# Altium schematic sheet panel6.SchDoc
size A
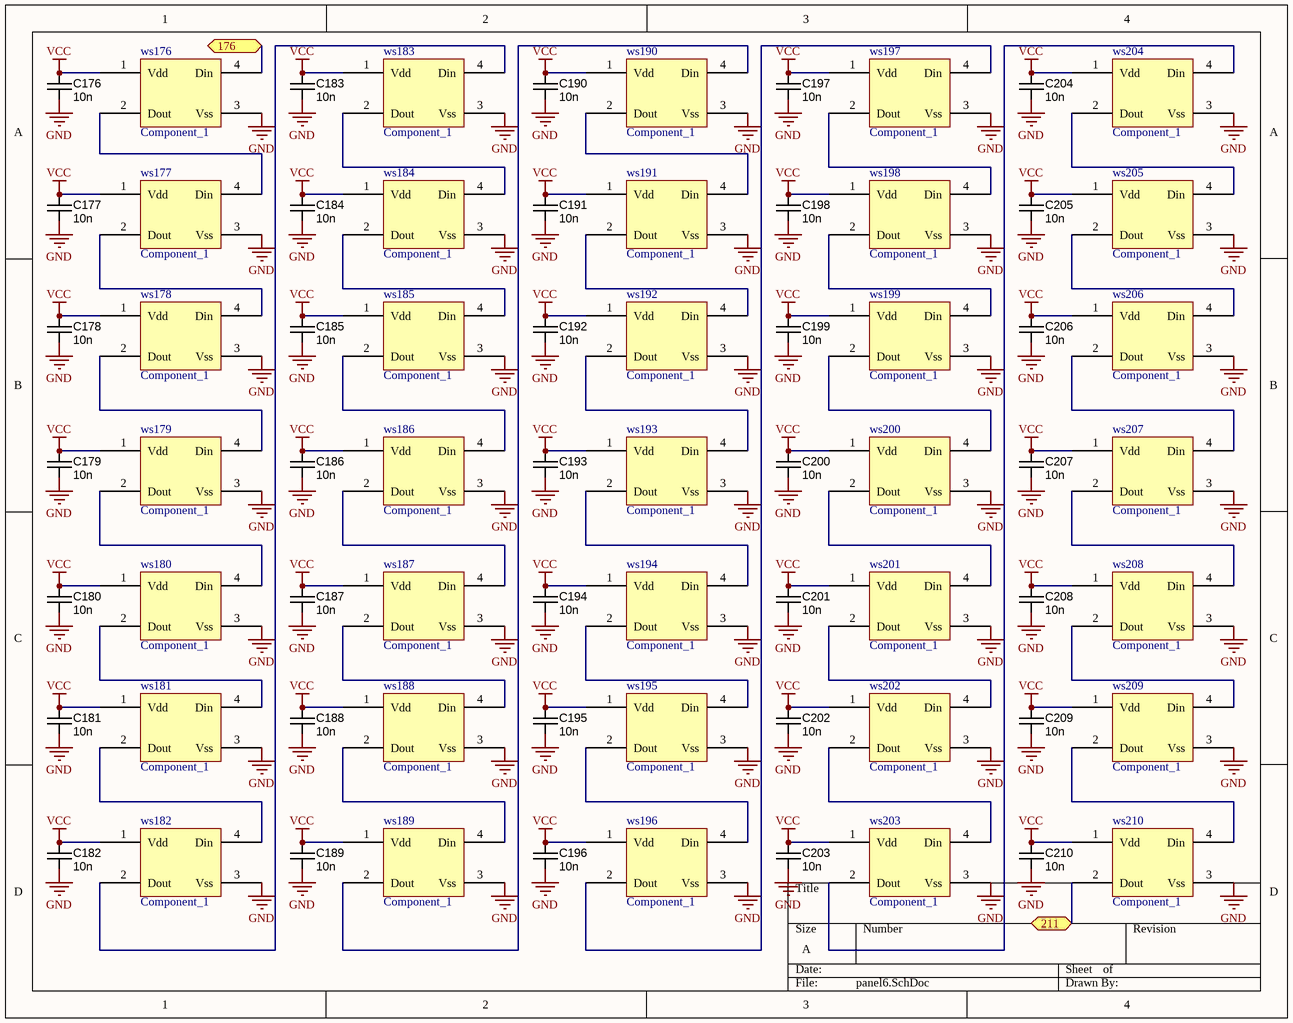
[diagram p0: panel6.SchDoc]

## Parts
C176  value 10n  [CAPC1608X90N]  (hidden comment: approved sub OK)
C177  value 10n  [CAPC1608X90N]  (hidden comment: approved sub OK)
C178  value 10n  [CAPC1608X90N]  (hidden comment: approved sub OK)
C179  value 10n  [CAPC1608X90N]  (hidden comment: approved sub OK)
C180  value 10n  [CAPC1608X90N]  (hidden comment: approved sub OK)
C181  value 10n  [CAPC1608X90N]  (hidden comment: approved sub OK)
C182  value 10n  [CAPC1608X90N]  (hidden comment: approved sub OK)
C183  value 10n  [CAPC1608X90N]  (hidden comment: approved sub OK)
C184  value 10n  [CAPC1608X90N]  (hidden comment: approved sub OK)
C185  value 10n  [CAPC1608X90N]  (hidden comment: approved sub OK)
C186  value 10n  [CAPC1608X90N]  (hidden comment: approved sub OK)
C187  value 10n  [CAPC1608X90N]  (hidden comment: approved sub OK)
C188  value 10n  [CAPC1608X90N]  (hidden comment: approved sub OK)
C189  value 10n  [CAPC1608X90N]  (hidden comment: approved sub OK)
C190  value 10n  [CAPC1608X90N]  (hidden comment: approved sub OK)
C191  value 10n  [CAPC1608X90N]  (hidden comment: approved sub OK)
C192  value 10n  [CAPC1608X90N]  (hidden comment: approved sub OK)
C193  value 10n  [CAPC1608X90N]  (hidden comment: approved sub OK)
C194  value 10n  [CAPC1608X90N]  (hidden comment: approved sub OK)
C195  value 10n  [CAPC1608X90N]  (hidden comment: approved sub OK)
C196  value 10n  [CAPC1608X90N]  (hidden comment: approved sub OK)
C197  value 10n  [CAPC1608X90N]  (hidden comment: approved sub OK)
C198  value 10n  [CAPC1608X90N]  (hidden comment: approved sub OK)
C199  value 10n  [CAPC1608X90N]  (hidden comment: approved sub OK)
C200  value 10n  [CAPC1608X90N]  (hidden comment: approved sub OK)
C201  value 10n  [CAPC1608X90N]  (hidden comment: approved sub OK)
C202  value 10n  [CAPC1608X90N]  (hidden comment: approved sub OK)
C203  value 10n  [CAPC1608X90N]  (hidden comment: approved sub OK)
C204  value 10n  [CAPC1608X90N]  (hidden comment: approved sub OK)
C205  value 10n  [CAPC1608X90N]  (hidden comment: approved sub OK)
C206  value 10n  [CAPC1608X90N]  (hidden comment: approved sub OK)
C207  value 10n  [CAPC1608X90N]  (hidden comment: approved sub OK)
C208  value 10n  [CAPC1608X90N]  (hidden comment: approved sub OK)
C209  value 10n  [CAPC1608X90N]  (hidden comment: approved sub OK)
C210  value 10n  [CAPC1608X90N]  (hidden comment: approved sub OK)
ws176  Component_1  [SOP4]
ws177  Component_1  [SOP4]
ws178  Component_1  [SOP4]
ws179  Component_1  [SOP4]
ws180  Component_1  [SOP4]
ws181  Component_1  [SOP4]
ws182  Component_1  [SOP4]
ws183  Component_1  [SOP4]
ws184  Component_1  [SOP4]
ws185  Component_1  [SOP4]
ws186  Component_1  [SOP4]
ws187  Component_1  [SOP4]
ws188  Component_1  [SOP4]
ws189  Component_1  [SOP4]
ws190  Component_1  [SOP4]
ws191  Component_1  [SOP4]
ws192  Component_1  [SOP4]
ws193  Component_1  [SOP4]
ws194  Component_1  [SOP4]
ws195  Component_1  [SOP4]
ws196  Component_1  [SOP4]
ws197  Component_1  [SOP4]
ws198  Component_1  [SOP4]
ws199  Component_1  [SOP4]
ws200  Component_1  [SOP4]
ws201  Component_1  [SOP4]
ws202  Component_1  [SOP4]
ws203  Component_1  [SOP4]
ws204  Component_1  [SOP4]
ws205  Component_1  [SOP4]
ws206  Component_1  [SOP4]
ws207  Component_1  [SOP4]
ws208  Component_1  [SOP4]
ws209  Component_1  [SOP4]
ws210  Component_1  [SOP4]

## Ports
176, 211

## Nets
GND: C176.2 C177.2 C178.2 C179.2 C180.2 C181.2 C182.2 C183.2 C184.2 C185.2 C186.2 C187.2 C188.2 C189.2 C190.2 C191.2 C192.2 C193.2 C194.2 C195.2 C196.2 C197.2 C198.2 C199.2 C200.2 C201.2 C202.2 C203.2 C204.2 C205.2 C206.2 C207.2 C208.2 C209.2 C210.2 ws176.3(Vss) ws177.3(Vss) ws178.3(Vss) ws179.3(Vss) ws180.3(Vss) ws181.3(Vss) ws182.3(Vss) ws183.3(Vss) ws184.3(Vss) ws185.3(Vss) ws186.3(Vss) ws187.3(Vss) ws188.3(Vss) ws189.3(Vss) ws190.3(Vss) ws191.3(Vss) ws192.3(Vss) ws193.3(Vss) ws194.3(Vss) ws195.3(Vss) ws196.3(Vss) ws197.3(Vss) ws198.3(Vss) ws199.3(Vss) ws200.3(Vss) ws201.3(Vss) ws202.3(Vss) ws203.3(Vss) ws204.3(Vss) ws205.3(Vss) ws206.3(Vss) ws207.3(Vss) ws208.3(Vss) ws209.3(Vss) ws210.3(Vss)
VCC: C176.1 C177.1 C178.1 C179.1 C180.1 C181.1 C182.1 C183.1 C184.1 C185.1 C186.1 C187.1 C188.1 C189.1 C190.1 C191.1 C192.1 C193.1 C194.1 C195.1 C196.1 C197.1 C198.1 C199.1 C200.1 C201.1 C202.1 C203.1 C204.1 C205.1 C206.1 C207.1 C208.1 C209.1 C210.1 ws176.1(Vdd) ws177.1(Vdd) ws178.1(Vdd) ws179.1(Vdd) ws180.1(Vdd) ws181.1(Vdd) ws182.1(Vdd) ws183.1(Vdd) ws184.1(Vdd) ws185.1(Vdd) ws186.1(Vdd) ws187.1(Vdd) ws188.1(Vdd) ws189.1(Vdd) ws190.1(Vdd) ws191.1(Vdd) ws192.1(Vdd) ws193.1(Vdd) ws194.1(Vdd) ws195.1(Vdd) ws196.1(Vdd) ws197.1(Vdd) ws198.1(Vdd) ws199.1(Vdd) ws200.1(Vdd) ws201.1(Vdd) ws202.1(Vdd) ws203.1(Vdd) ws204.1(Vdd) ws205.1(Vdd) ws206.1(Vdd) ws207.1(Vdd) ws208.1(Vdd) ws209.1(Vdd) ws210.1(Vdd)
176: ws176.4(Din) ; port 176
211: ws210.2(Dout) ; port 211
Netws176_2: ws176.2(Dout) ws177.4(Din)
Netws177_2: ws177.2(Dout) ws178.4(Din)
Netws178_2: ws178.2(Dout) ws179.4(Din)
Netws179_2: ws179.2(Dout) ws180.4(Din)
Netws180_2: ws180.2(Dout) ws181.4(Din)
Netws181_2: ws181.2(Dout) ws182.4(Din)
Netws182_2: ws182.2(Dout) ws183.4(Din)
Netws183_2: ws183.2(Dout) ws184.4(Din)
Netws184_2: ws184.2(Dout) ws185.4(Din)
Netws185_2: ws185.2(Dout) ws186.4(Din)
Netws186_2: ws186.2(Dout) ws187.4(Din)
Netws187_2: ws187.2(Dout) ws188.4(Din)
Netws188_2: ws188.2(Dout) ws189.4(Din)
Netws189_2: ws189.2(Dout) ws190.4(Din)
Netws190_2: ws190.2(Dout) ws191.4(Din)
Netws191_2: ws191.2(Dout) ws192.4(Din)
Netws192_2: ws192.2(Dout) ws193.4(Din)
Netws193_2: ws193.2(Dout) ws194.4(Din)
Netws194_2: ws194.2(Dout) ws195.4(Din)
Netws195_2: ws195.2(Dout) ws196.4(Din)
Netws196_2: ws196.2(Dout) ws197.4(Din)
Netws197_2: ws197.2(Dout) ws198.4(Din)
Netws198_2: ws198.2(Dout) ws199.4(Din)
Netws199_2: ws199.2(Dout) ws200.4(Din)
Netws200_2: ws200.2(Dout) ws201.4(Din)
Netws201_2: ws201.2(Dout) ws202.4(Din)
Netws202_2: ws202.2(Dout) ws203.4(Din)
Netws203_2: ws203.2(Dout) ws204.4(Din)
Netws204_2: ws204.2(Dout) ws205.4(Din)
Netws205_2: ws205.2(Dout) ws206.4(Din)
Netws206_2: ws206.2(Dout) ws207.4(Din)
Netws207_2: ws207.2(Dout) ws208.4(Din)
Netws208_2: ws208.2(Dout) ws209.4(Din)
Netws209_2: ws209.2(Dout) ws210.4(Din)

## Library data of the parts
C176-C210 = CAPC_10n_0603_X7R_100V_10%: Capacitor SMD Cer 10nF 10% 100V X7R 0603; Manufacturer: Murata Electronics North America; Manufacturer Part Number: GCM188R72A103KA37D; Ratings: 100V; X7R; Material: ceramic; SCDType: undef; Package / Case: 0603 (1608 metric); Tolerance: ±10%; Supplier 1: Digi-Key; Supplier Part Number 1: 490-4781-1-ND